# EAGLE design motorcontroller_doppeleinheit (EAGLE 7.7.0)
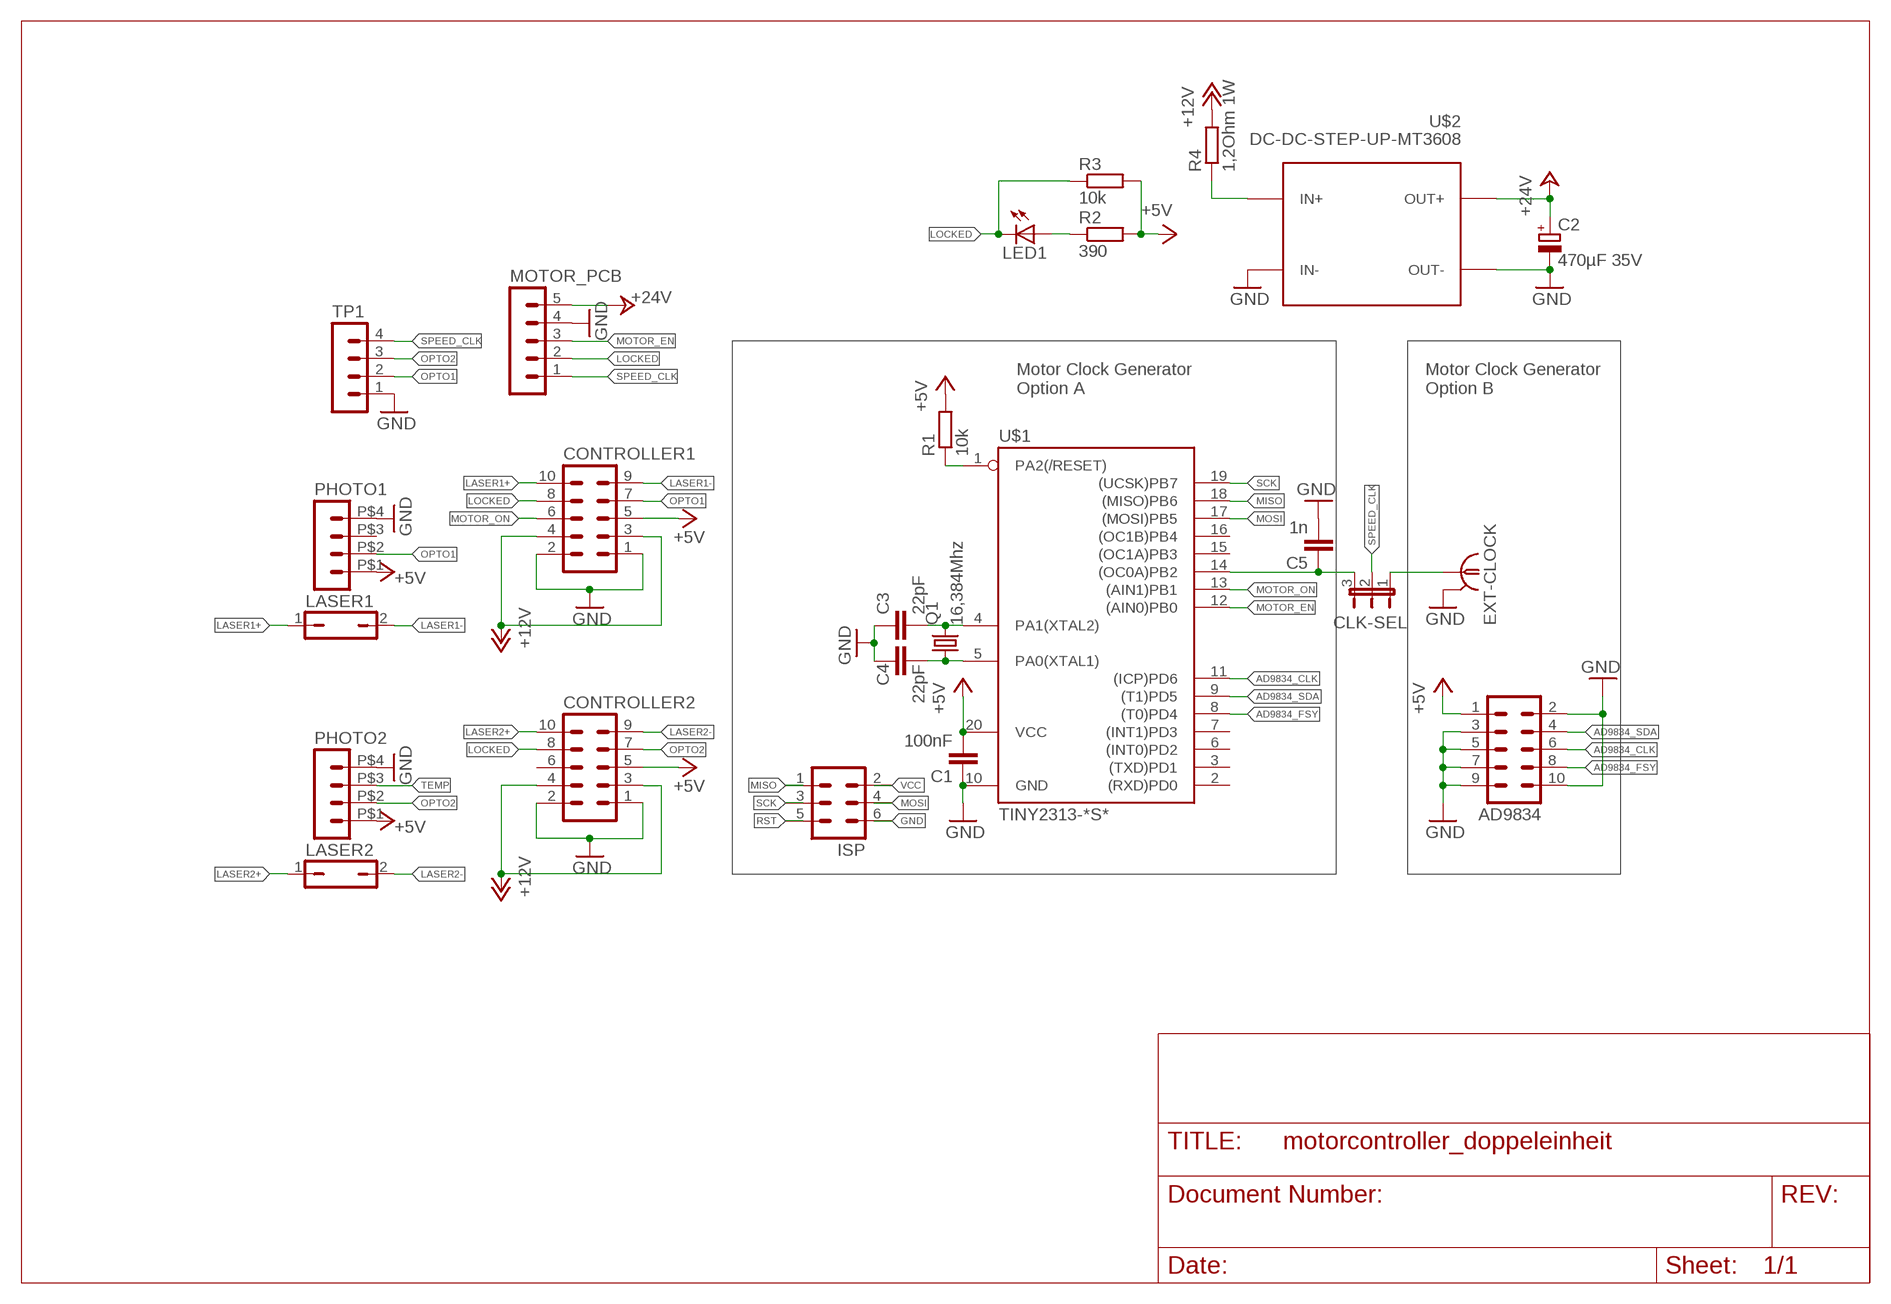
[diagram p0: schematic, sheet 1]

## Parts
AD9834  ML10  [ML10]
C1  100nF  C-EUC1206  [C1206]
C2  470µF 35V  CPOL-EUE5-6  [E5-6]
C3  22pF  C-EUC1206  [C1206]
C4  22pF  C-EUC1206  [C1206]
C5  1n  C-EUC1206  [C1206]
CLK-SEL  JP2E  [JP2]
CONTROLLER1  ML10  [ML10]
CONTROLLER2  ML10  [ML10]
EXT-CLOCK  LTI-SASF54GT  [LTI-SASF54GT]
ISP  ML6L  [ML6L]
LASER1  JP1Q  [JP1]
LASER2  JP1Q  [JP1]
LED1  LED3MM  [LED3MM]
MOTOR_PCB  MA05-1  [MA05-1]
PHOTO1  FLAT_P4  [FLAT_4P]
PHOTO2  FLAT_P4  [FLAT_4P]
Q1  16,384Mhz  CRYSTALHC49UP  [HC49UP]
R1  10k  R-EU_R1206  [R1206]
R2  390  R-EU_R1206  [R1206]
R3  10k  R-EU_R1206  [R1206]
R4  1,2Ohm 1W  R-EU_0411/15  [0411/15]
TP1  MA04-1  [MA04-1]
U$1  TINY2313-*S*  [SO20L$]
U$2  DC-DC-STEP-UP-MT3608  [DC-DC-STEP-UP-MT3608]

## Nets
+5V: AD9834.1 C1.2 CONTROLLER1.5 CONTROLLER2.5 PHOTO1.P$1 PHOTO2.P$1 R1.2 R2.2 R3.2 U$1.20(VCC)
+12V: CONTROLLER1.3 CONTROLLER1.4 CONTROLLER2.3 CONTROLLER2.4 R4.2
+24V: C2.+ MOTOR_PCB.5 U$2.OUT+
AD9834_CLK: AD9834.6 U$1.11((ICP)PD6)
AD9834_FSY: AD9834.8 U$1.8((T0)PD4)
AD9834_SDA: AD9834.4 U$1.9((T1)PD5)
GND: AD9834.2 AD9834.3 AD9834.5 AD9834.7 AD9834.9 AD9834.10 C1.1 C2.- C3.1 C4.1 C5.2 CONTROLLER1.1 CONTROLLER1.2 CONTROLLER2.1 CONTROLLER2.2 EXT-CLOCK.2 EXT-CLOCK.3 EXT-CLOCK.4 EXT-CLOCK.5 ISP.6 MOTOR_PCB.4 PHOTO1.P$4 PHOTO2.P$4 TP1.1 U$1.10(GND) U$2.IN- U$2.OUT-
LASER1+: CONTROLLER1.10 LASER1.1
LASER1-: CONTROLLER1.9 LASER1.2
LASER2+: CONTROLLER2.10 LASER2.1
LASER2-: CONTROLLER2.9 LASER2.2
LOCKED: CONTROLLER1.8 CONTROLLER2.8 LED1.K(C) MOTOR_PCB.2 R3.1
MISO: ISP.1 U$1.18((MISO)PB6)
MOSI: ISP.4 U$1.17((MOSI)PB5)
MOTOR_EN: MOTOR_PCB.3 U$1.12((AIN0)PB0)
MOTOR_ON: CONTROLLER1.6 U$1.13((AIN1)PB1)
N$1: C4.2 Q1.1 U$1.5(PA0(XTAL1))
N$2: LED1.A R2.1
N$3: C5.1 CLK-SEL.3 U$1.14((OC0A)PB2)
N$4: CLK-SEL.1 EXT-CLOCK.1
N$5: C3.2 Q1.2 U$1.4(PA1(XTAL2))
N$6: R4.1 U$2.IN+
OPTO1: CONTROLLER1.7 PHOTO1.P$2 TP1.2
OPTO2: CONTROLLER2.7 PHOTO2.P$2 TP1.3
RST: ISP.5 R1.1 U$1.1(PA2(/RESET))
SCK: ISP.3 U$1.19((UCSK)PB7)
SPEED_CLK: CLK-SEL.2 MOTOR_PCB.1 TP1.4
TEMP: PHOTO2.P$3
VCC: ISP.2
Unconnected: CONTROLLER2.6 PHOTO1.P$3 U$1.2((RXD)PD0) U$1.3((TXD)PD1) U$1.6((INT0)PD2) U$1.7((INT1)PD3) U$1.15((OC1A)PB3) U$1.16((OC1B)PB4)

## Notes on the sheet
- Motor Clock Generator
  Option A
- Motor Clock Generator
  Option B

## Library data of the parts
AD9834 CONTROLLER1 CONTROLLER2 = con-ml:ML10: HARTING; OC_FARNELL: unknown; OC_NEWARK: unknown
C1 C3-C5 = rcl:C-EU: CAPACITOR, European symbol
C2 = rcl:CPOL-EU: POLARIZED CAPACITOR, European symbol
CLK-SEL = jumper:JP2E: JUMPER
EXT-CLOCK = con-coax:LTI-SASF54GT: SMA vertical PCB thrue hole jack Source: Lighthorse Technologies, inc. SASF54GT.pdf; OC_FARNELL: unknown; OC_NEWARK: unknown
ISP = con-harting-ml:ML6: HARTING; OC_FARNELL: unknown; OC_NEWARK: unknown
LASER1 LASER2 = jumper:JP1Q: JUMPER
LED1 = led:LED: LED OSRAM: - CHIPLED LG R971, LG N971, LY N971, LG Q971, LY Q971, LO R971, LY R971 LH N974, LH R974 LS Q976, LO Q976, LY Q976 LO Q996 - Hyper CHIPLED LW Q18S LB Q993, LB Q99A, LB R99A - SideLED LS A670, LO A670, LY A670, LG A670, LP A670 LB A673, LV A673, LT A673, LW A673 LH A674 LY A675 LS A676, LA A676, LO A676, LY A676, LW A676 LS A679, LY A679, LG A679 - Hyper Micro SIDELED® LS Y876, LA Y876, LO Y876, LY Y876 LT Y87S - SmartLED LW L88C, LW L88S LB L89C, LB L89S, LG L890 LS L89K, LO L89K, LY L89K LS L896, LA L896, LO L896, LY L896 - TOPLED LS T670, LO T670, LY T670, LG T670, LP T670 LSG T670, LSP T670, LSY T670, LOP T670, LYG T670 LG T671, LOG T671, LSG T671 LB T673, LV T673, LT T673, LW T673 LH T674 LS T676, LA T676, LO T676, LY T676, LB T676, LH T676, LSB T676, LW T676 LB T67C, LV T67C, LT T67C, LS T67K, LO T67K, LY T67K, LW E67C LS E67B, LA E67B, LO E67B, LY E67B, LB E67C, LV E67C, LT E67C LW T67C LS T679, LY T679, LG T679 LS T770, LO T770, LY T770, LG T770, LP T770 LB T773, LV T773, LT T773, LW T773 LH T774 LS E675, LA E675, LY E675, LS T675 LS T776, LA T776, LO T776, LY T776, LB T776 LHGB T686 LT T68C, LB T68C - Hyper Mini TOPLED® LB M676 - Mini TOPLED Santana® LG M470 LS M47K, LO M47K, LY M47K Source: http://www.osram.convergy.de LUXEON: - LUMILED® LXK2-PW12-R00, LXK2-PW12-S00, LXK2-PW14-U00, LXK2-PW14-V00 LXK2-PM12-R00, LXK2-PM12-S00, LXK2-PM14-U00 LXK2-PE12-Q00, LXK2-PE12-R00, LXK2-PE12-S00, LXK2-PE14-T00, LXK2-PE14-U00 LXK2-PB12-K00, LXK2-PB12-L00, LXK2-PB12-M00, LXK2-PB14-N00, LXK2-PB14-P00, LXK2-PB14-Q00 LXK2-PR12-L00, LXK2-PR12-M00, LXK2-PR14-Q00, LXK2-PR14-R00 LXK2-PD12-Q00, LXK2-PD12-R00, LXK2-PD12-S00 LXK2-PH12-R00, LXK2-PH12-S00 LXK2-PL12-P00, LXK2-PL12-Q00, LXK2-PL12-R00 Source: www.luxeon.com KINGBRIGHT: KA-3528ASYC Source: www.kingbright.com
MOTOR_PCB = con-lstb:MA05-1: PIN HEADER; OC_FARNELL: unknown; OC_NEWARK: unknown
PHOTO1 PHOTO2 = _custom_con:FLAT_P4
Q1 = crystal:CRYSTAL: CRYSTAL; OC_FARNELL: unknown; OC_NEWARK: unknown
R1-R4 = rcl:R-EU_: RESISTOR, European symbol
TP1 = con-lstb:MA04-1: PIN HEADER; OC_FARNELL: unknown; OC_NEWARK: unknown
U$1 = avr-7:TINY2313*: Atmel Tiny2313 2K Flash, 128 bytes EEPROM, 128 bytes RAM
U$2 = diy-modules:DC-DC-STEP-UP-MT3608: DC/DC Step-Up Regulator based on MT3608 chip MT3608 datasheet available here: https://www.olimex.com/Products/Breadboarding/BB-PWR-3608/resources/MT3608.pdf Click here to find device on ebay.com <http://www.ebay.com/sch/mt3608+module>

## Board
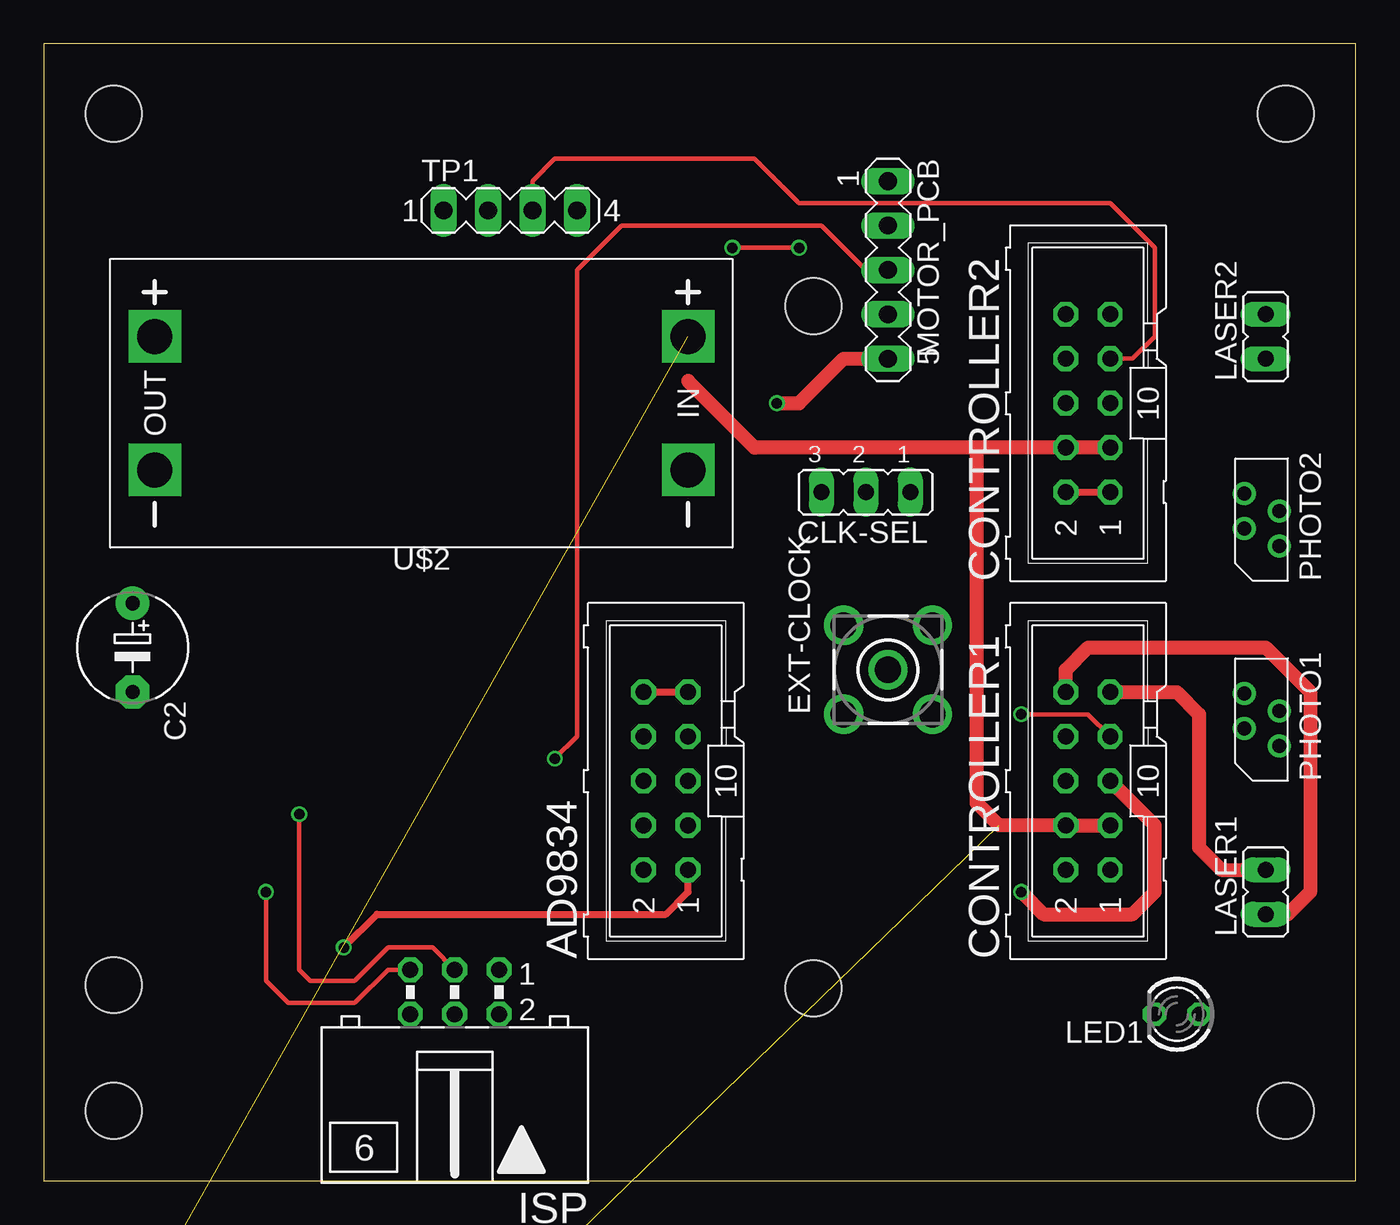
[diagram p1: board, top side]
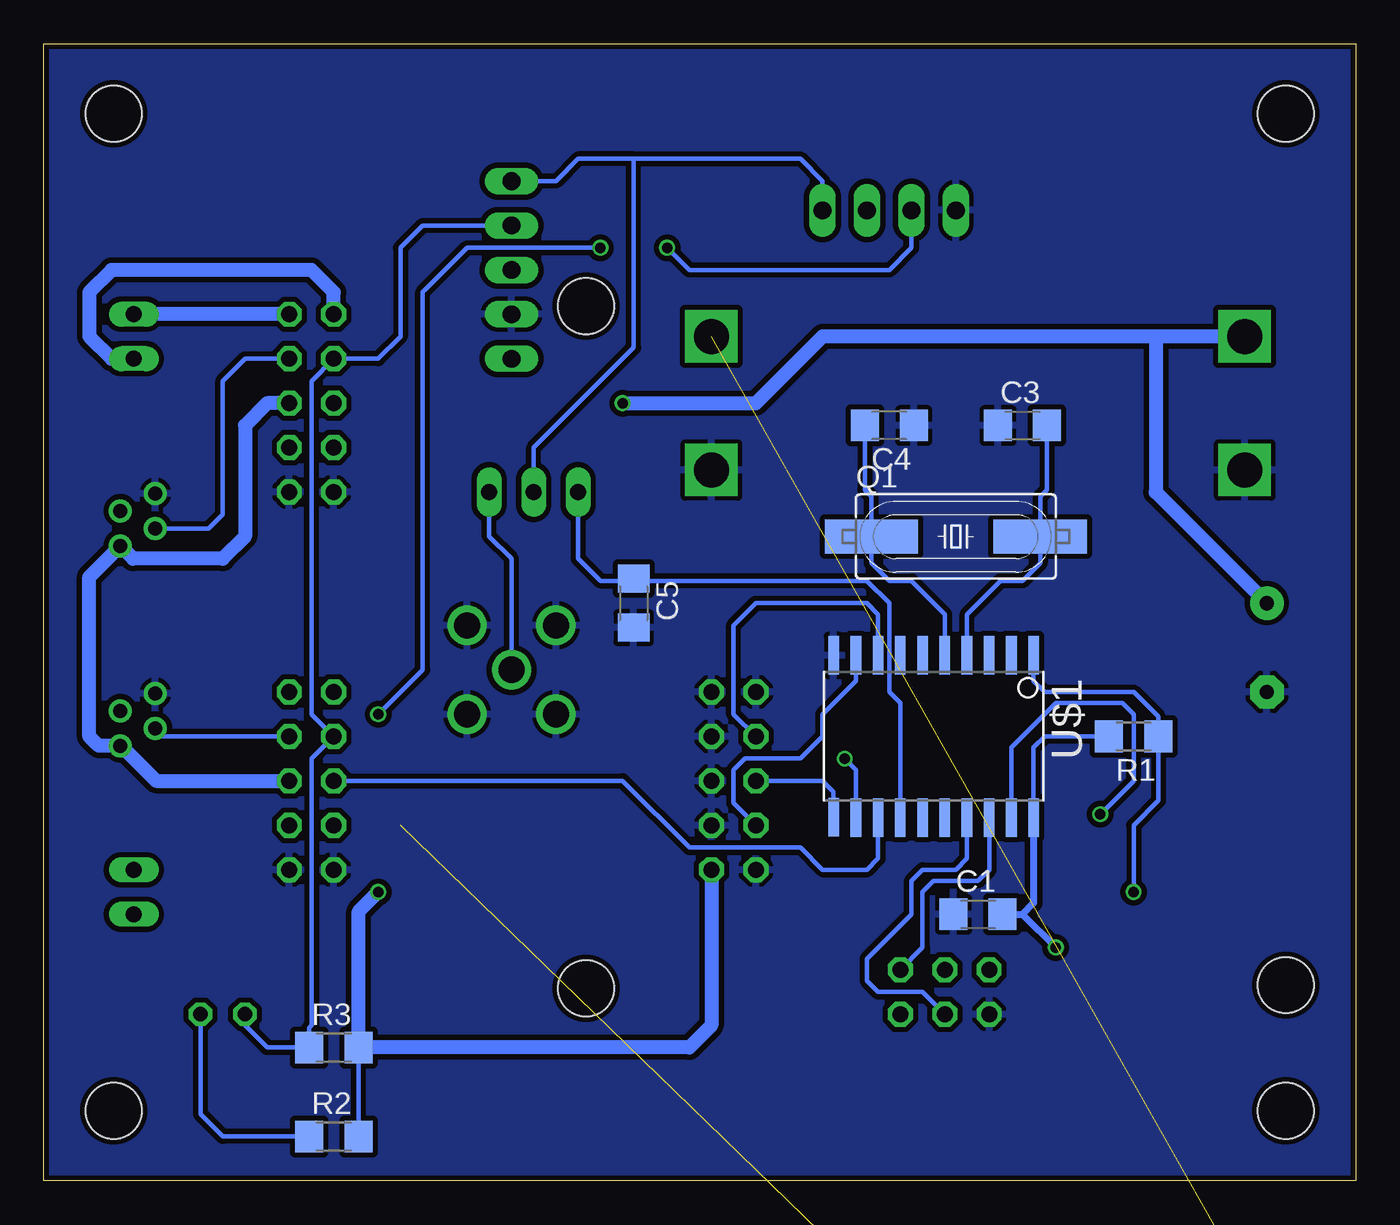
[diagram p2: board, bottom side, seen from below]

Size 75 x 65 mm. Coordinates in mm from the lower left corner, seen from the top.
Outline: 75,0 75,65 0,65 0,0 75,0
Copper layers (1*16): Top 0.035mm / dielectric 1.5mm / Bottom 0.035mm
Design rules "dirt_cheap_dirty_boards.v1": minimum track width 5mil, minimum drill 12mil, track to track 5mil, track to pad 5mil, pad to pad 5mil, via to via 5mil, smd to smd 0mil, copper to edge 10mil, drill to drill 10mil, minimum pad ring 10mil, minimum via ring 6mil, stop-mask expansion 2mil, vias tented up to drill 25mil, thermal gap 10mil
Holes 3.2 mm at 4,61 71,61 71,4 4,4 4,11.19 44,11 44,50

### Footprints (pad centres in the part's own frame; a part is rotated, then mirrored left to right if it is on the bottom)
ML10 = drill 0.914 octagon: 1 -5.08,-1.27; 2 -5.08,1.27; 3 -2.54,-1.27; 4 -2.54,1.27; 5 0,-1.27; 6 0,1.27; 7 2.54,-1.27; 8 2.54,1.27; 9 5.08,-1.27; 10 5.08,1.27
C1206 = smd 1.6 x 1.8: 1 -1.4,0; 2 1.4,0
E5-6 = drill 0.813 pad 1.905: + -2.54,0 | drill 0.813 pad 1.905 octagon: - 2.54,0
JP2 = drill 0.914 long: 1 -2.54,0; 2 0,0; 3 2.54,0
LTI-SASF54GT = drill 1.5 pad 2.2: 1 0,0; 2 -2.54,2.54; 3 2.54,2.54; 4 2.54,-2.54; 5 -2.54,-2.54
ML6L = drill 0.914 octagon: 1 -2.54,-1.27; 2 -2.54,1.27; 3 0,-1.27; 4 0,1.27; 5 2.54,-1.27; 6 2.54,1.27
JP1 = drill 0.914 long: 1 0,-1.27; 2 0,1.27
LED3MM = drill 0.813 octagon: A -1.27,0; K 1.27,0
MA05-1 = drill 1.016 long: 1 -5.08,0; 2 -2.54,0; 3 0,0; 4 2.54,0; 5 5.08,0
FLAT_4P = drill 0.8: P$1 2,0.5; P$2 3,2.5; P$3 4,0.5; P$4 5,2.5
HC49UP = smd 5.334 x 1.93: 1 -4.826,0; 2 4.826,0
R1206 = smd 1.6 x 1.803: 1 -1.422,0; 2 1.422,0
0411/15 = drill 0.914 octagon: 1 -7.62,0; 2 7.62,0
MA04-1 = drill 1.016 long: 1 -3.81,0; 2 -1.27,0; 3 1.27,0; 4 3.81,0
SO20L$ = smd 0.61 x 2.21: 1 -5.715,-4.636; 2 -4.445,-4.636; 3 -3.175,-4.636; 4 -1.905,-4.636; 5 -0.635,-4.636; 6 0.635,-4.636; 7 1.905,-4.636; 8 3.175,-4.636; 9 4.445,-4.636; 10 5.715,-4.636; 11 5.715,4.61; 12 4.445,4.636; 13 3.175,4.636; 14 1.905,4.636; 15 0.635,4.636; 16 -0.635,4.636; 17 -1.905,4.636; 18 -3.175,4.636; 19 -4.445,4.636; 20 -5.715,4.636
DC-DC-STEP-UP-MT3608 = drill 2 pad 2.8 square: IN+ 15.24,3.81; IN- 15.24,-3.81; OUT+ -15.24,3.81; OUT- -15.24,-3.81

### Placement (x,y rotation side)
AD9834  35.56,22.86 90 top
C1  21.59,15.24 0 bottom
C2  5.08,30.48 270 top
C3  19.05,43.18 0 bottom
C4  26.67,43.18 180 bottom
C5  41.27,33.02 270 bottom
CLK-SEL  46.99,39.37 180 top
CONTROLLER1  59.69,22.86 90 top
CONTROLLER2  59.69,44.45 90 top
EXT-CLOCK  48.26,29.21 90 top
ISP  23.5,10.79 180 top
LASER1  69.85,16.51 0 top
LASER2  69.85,48.26 0 top
LED1  64.77,9.53 180 top
MOTOR_PCB  48.26,52.07 270 top
PHOTO1  71.12,22.86 90 top
PHOTO2  71.12,34.29 90 top
Q1  22.86,36.83 0 bottom
R1  12.7,25.4 180 bottom
R2  58.42,2.54 0 bottom
R3  58.42,7.62 0 bottom
R4  6.35,-19.05 0 top  (outside the outline)
TP1  26.67,55.48 0 top
U$1  24.13,25.4 180 bottom
U$2  21.59,44.45 0 top

### Tracks (layer width: path | path; a pad name or v marks a point on that pad's centre or on a via)
+5V  (via drill 0.6)
  Top 0.406: v17.14,13.34 19.05,15.24 35.56,15.24 36.83,16.51 AD9834.1
  Top 0.813: v55.88,16.51 57.15,15.24 62.23,15.24 63.5,16.51 63.5,20.32 CONTROLLER1.5
  Bottom 0.254: R1.2 17.78,25.4 18.41,24.77 U$1.20 | R2.2 R3.2
  Bottom 0.406: U$1.20 18.41,15.88 19.05,15.24 | PHOTO1.P$1 70.58,24.86 | C1.2 19.05,15.24 | 19.05,15.24 v17.14,13.34
  Bottom 0.813: AD9834.1 36.83,8.89 38.1,7.62 R3.2 57,15.39 v55.88,16.51 | 70.58,24.86 68.58,22.86 CONTROLLER1.5 | PHOTO1.P$1 71.85,24.86 72.39,25.4 72.39,34.52 PHOTO2.P$1 69.89,35.56 64.77,35.56 63.5,36.83 63.5,43.18 62.23,44.45 CONTROLLER2.5
+12V  (1 unrouted)
  Top 0.813: CONTROLLER2.3 CONTROLLER2.4 53.34,41.91 | 53.34,41.91 40.64,41.91 36.83,45.72 | CONTROLLER1.3 CONTROLLER1.4 54.61,20.32 53.34,21.59 53.34,41.91
+24V  (via drill 0.6)
  Top 0.813: v41.91,44.45 43.18,44.45 45.72,46.99 MOTOR_PCB.5
  Bottom 0.813: U$2.OUT+ 11.43,48.26 | 11.43,48.26 11.43,39.37 C2.+ | 11.43,48.26 30.48,48.26 34.29,44.45 v41.91,44.45
AD9834_CLK
  Bottom 0.254: AD9834.6 30.48,22.86 29.84,22.23 U$1.11
AD9834_FSY
  Bottom 0.254: AD9834.8 35.56,26.67 35.56,31.75 34.29,33.02 27.94,33.02 27.3,32.38 U$1.8
AD9834_SDA
  Bottom 0.254: U$1.9 28.57,28.57 30.48,26.67 30.48,25.4 31.75,24.13 34.92,24.13 35.56,23.5 35.56,21.59 AD9834.4
GND
  Top 0.406: AD9834.10 AD9834.9 | CONTROLLER2.2 CONTROLLER2.1
  pour Bottom (isolate 0.305): 0,64.77 0,0 74.93,0 74.93,64.77
LASER1+
  Top 0.813: CONTROLLER1.10 58.42,29.21 59.69,30.48 69.85,30.48 72.39,27.94 72.39,16.51 71.12,15.24 LASER1.1
LASER1-
  Top 0.813: CONTROLLER1.9 64.77,27.94 66.04,26.67 66.04,19.05 67.31,17.78 LASER1.2
LASER2+
  Bottom 0.813: CONTROLLER2.10 58.42,50.8 59.69,52.07 71.12,52.07 72.39,50.8 72.39,48.26 71.12,46.99 LASER2.1
LASER2-
  Bottom 0.813: CONTROLLER2.9 LASER2.2
LOCKED
  Bottom 0.254: MOTOR_PCB.2 53.34,54.61 54.61,53.34 54.61,48.26 55.88,46.99 CONTROLLER2.8 59.69,45.72 59.69,26.67 CONTROLLER1.8 59.69,24.13 59.69,8.89 59.84,8.74 R3.1 62.23,7.62 63.5,8.89 LED1.K
MISO
  Bottom 0.254: U$1.18 20.95,17.78 21.59,17.14 24.13,17.14 24.77,16.51 24.77,13.34 ISP.1
MOSI
  Bottom 0.254: U$1.17 22.23,18.41 22.86,17.78 24.77,17.78 25.4,17.14 25.4,15.24 27.94,12.7 27.94,11.43 27.3,10.79 24.77,10.79 ISP.4
MOTOR_EN  (via drill 0.6)
  Top 0.254: v29.21,24.13 30.48,25.4 30.48,52.07 33.02,54.61 44.45,54.61 46.99,52.07 MOTOR_PCB.3
  Bottom 0.254: v29.21,24.13 28.57,23.5 U$1.12
MOTOR_ON
  Bottom 0.254: CONTROLLER1.6 41.91,22.86 38.1,19.05 31.75,19.05 30.48,17.78 27.94,17.78 27.3,18.41 U$1.13
N$1
  Bottom 0.254: C4.2 28.07,39.5 27.69,39.12 Q1.1 27.69,35.31 26.67,34.29 25.4,34.29 23.5,32.38 U$1.5
N$2
  Bottom 0.254: R2.1 64.77,2.54 66.04,3.81 LED1.A
N$3
  Bottom 0.254: U$1.14 26.04,27.3 26.67,27.94 26.67,33.02 27.94,34.29 41.15,34.29 C5.1 41.41,34.29 43.18,34.29 44.45,35.56 CLK-SEL.3
N$4
  Bottom 0.254: EXT-CLOCK.1 48.26,35.56 49.53,36.83 CLK-SEL.1
N$5
  Bottom 0.254: C3.2 17.65,39.5 18.03,39.12 Q1.2 18.03,35.31 19.05,34.29 20.32,34.29 22.23,32.38 U$1.4
N$6  (1 unrouted)
OPTO1  (via drill 0.6)
  Top 0.254: CONTROLLER1.7 59.69,26.67 v55.88,26.67 | v43.18,53.34 v39.37,53.34
  Bottom 0.254: CONTROLLER1.7 68.16,25.4 PHOTO1.P$2 | v43.18,53.34 50.8,53.34 53.34,50.8 53.34,29.21 v55.88,26.67 | TP1.2 25.4,53.34 26.67,52.07 38.1,52.07 v39.37,53.34
OPTO2
  Top 0.254: CONTROLLER2.7 62.23,46.99 63.5,48.26 63.5,53.34 60.96,55.88 43.18,55.88 40.64,58.42 29.21,58.42 27.94,57.15 TP1.3
  Bottom 0.254: PHOTO2.P$2 65.58,37.29 64.77,38.1 64.77,45.72 63.5,46.99 CONTROLLER2.7
RST  (via drill 0.6)
  Top 0.254: ISP.5 19.68,12.06 17.78,10.16 13.97,10.16 12.7,11.43 v12.7,16.51
  Bottom 0.254: U$1.1 18.41,28.57 17.78,27.94 12.7,27.94 11.3,26.54 R1.1 11.28,21.74 12.7,20.32 v12.7,16.51
SCK  (via drill 0.6)
  Top 0.254: v14.61,20.95 14.61,12.06 15.24,11.43 17.78,11.43 19.68,13.34 22.23,13.34 ISP.3
  Bottom 0.254: v14.61,20.95 12.7,22.86 12.7,26.67 13.34,27.3 17.14,27.3 19.68,24.77 U$1.19
SPEED_CLK
  Bottom 0.254: TP1.4 30.48,57.15 31.75,58.42 41.27,58.42 | CLK-SEL.2 46.99,41.91 41.27,47.62 41.27,58.42 | 41.27,58.42 44.45,58.42 45.72,57.15 MOTOR_PCB.1

### Text on the board
tPlace: PHOTO2 | PHOTO1